# EAGLE design kartusho2 (EAGLE 7.3.0)
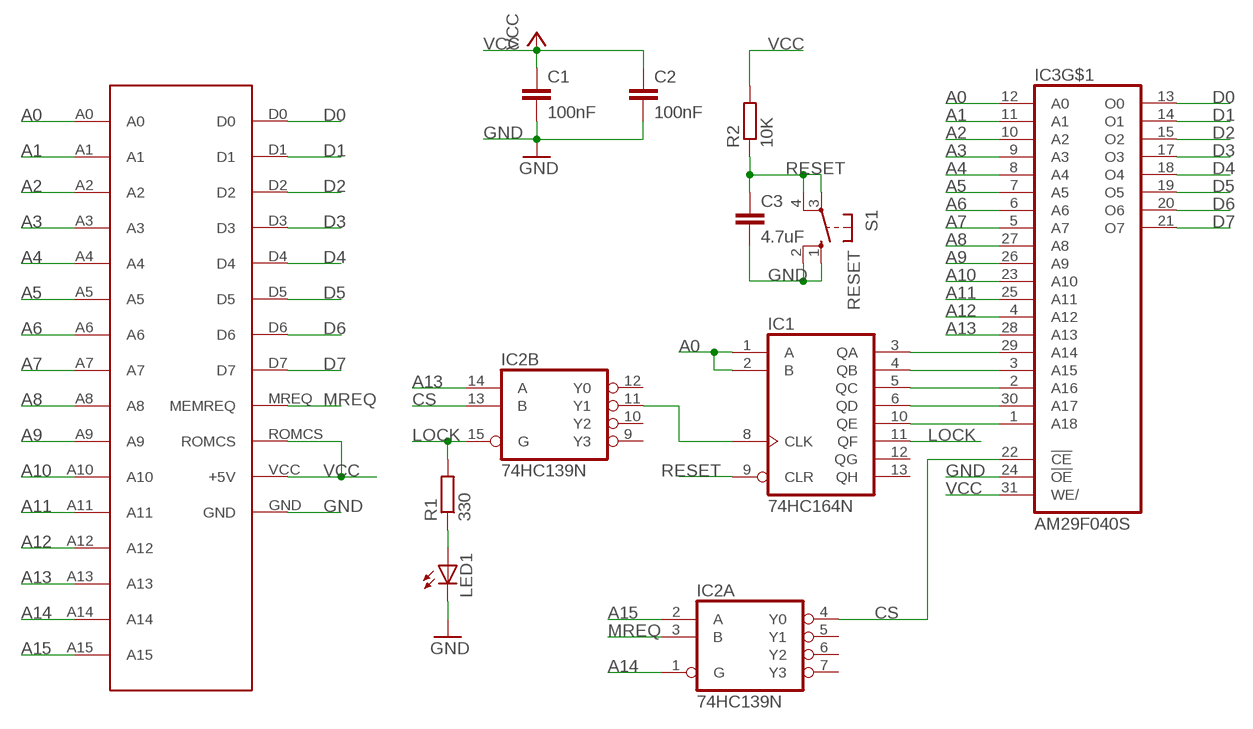
[diagram p0: schematic, sheet 1]

## Parts
C1  100nF  C-EU025-025X050  [C025-025X050]
C2  100nF  C-EU025-025X050  [C025-025X050]
C3  4.7uF  C-EU025-025X050  [C025-025X050]
IC1  74HC164N  [DIL14]
IC2  74HC139N  [DIL16]
IC3  AM29F040S  [PLCC-SR32]
LED1  LED3MM  [LED3MM]
R1  330  R-EU_0204/7  [0204/7]
R2  10K  R-EU_0204/7  [0204/7]
S1  RESET  10-XX  [B3F-10XX]
U$1  IF2BUS  [BUS_CARTUCHO_IF2]

## Nets
A0: IC1.1(A) IC1.2(B) IC3.12(A0) U$1.A0
A1: IC3.11(A1) U$1.A1
A2: IC3.10(A2) U$1.A2
A3: IC3.9(A3) U$1.A3
A4: IC3.8(A4) U$1.A4
A5: IC3.7(A5) U$1.A5
A6: IC3.6(A6) U$1.A6
A7: IC3.5(A7) U$1.A7
A8: IC3.27(A8) U$1.A8
A9: IC3.26(A9) U$1.A9
A10: IC3.23(A10) U$1.A10
A11: IC3.25(A11) U$1.A11
A12: IC3.4(A12) U$1.A12
A13: IC2.14(B:A) IC3.28(A13) U$1.A13
A14: IC2.1(A:G) U$1.A14
A15: IC2.2(A:A) U$1.A15
CS: IC2.4(A:Y0) IC2.13(B:B) IC3.22(!CE)
D0: IC3.13(O0) U$1.D0
D1: IC3.14(O1) U$1.D1
D2: IC3.15(O2) U$1.D2
D3: IC3.17(O3) U$1.D3
D4: IC3.18(O4) U$1.D4
D5: IC3.19(O5) U$1.D5
D6: IC3.20(O6) U$1.D6
D7: IC3.21(O7) U$1.D7
GND: C1.2 C2.2 C3.2 IC3.24(!OE) LED1.K(C) S1.1(S) S1.2(S1) U$1.GND
LOCK: IC1.11(QF) IC2.15(B:G) R1.2
MREQ: IC2.3(A:B) U$1.MREQ(MEMREQ)
N$1: IC1.8(CLK) IC2.11(B:Y1)
N$2: IC1.10(QE) IC3.1(A18)
N$3: IC1.6(QD) IC3.30(A17)
N$4: IC1.5(QC) IC3.2(A16)
N$5: IC1.4(QB) IC3.3(A15)
N$6: IC1.3(QA) IC3.29(A14)
N$7: LED1.A R1.1
RESET: C3.1 IC1.9(CLR) R2.1 S1.3(P) S1.4(P1)
VCC: C1.1 C2.1 IC3.31(WE/) R2.2 U$1.ROMCS U$1.VCC(+5V)
Unconnected: IC1.12(QG) IC1.13(QH) IC2.5(A:Y1) IC2.6(A:Y2) IC2.7(A:Y3) IC2.9(B:Y3) IC2.10(B:Y2) IC2.12(B:Y0)

## Power pins joined to a net without a drawn wire
GND: IC1.7(GND) IC2.8(P:GND) IC3.16(GND)
VCC: IC1.14(VCC) IC2.16(P:VCC) IC3.32(VCC)

## Library data of the parts
C1-C3 = rcl:C-EU: CAPACITOR, European symbol
IC1 = 74xx-us:74*164: 8-bit parallel out SHIFT REGISTER
IC2 = 74xx-eu:74*139: Dual 2-line to 4-line DECODER/DEMULTIPLEXER
IC3 = am29-memory:AM29F040S
LED1 = led:LED: LED OSRAM: - CHIPLED LG R971, LG N971, LY N971, LG Q971, LY Q971, LO R971, LY R971 LH N974, LH R974 LS Q976, LO Q976, LY Q976 LO Q996 - Hyper CHIPLED LW Q18S LB Q993, LB Q99A, LB R99A - SideLED LS A670, LO A670, LY A670, LG A670, LP A670 LB A673, LV A673, LT A673, LW A673 LH A674 LY A675 LS A676, LA A676, LO A676, LY A676, LW A676 LS A679, LY A679, LG A679 - Hyper Micro SIDELED® LS Y876, LA Y876, LO Y876, LY Y876 LT Y87S - SmartLED LW L88C, LW L88S LB L89C, LB L89S, LG L890 LS L89K, LO L89K, LY L89K LS L896, LA L896, LO L896, LY L896 - TOPLED LS T670, LO T670, LY T670, LG T670, LP T670 LSG T670, LSP T670, LSY T670, LOP T670, LYG T670 LG T671, LOG T671, LSG T671 LB T673, LV T673, LT T673, LW T673 LH T674 LS T676, LA T676, LO T676, LY T676, LB T676, LH T676, LSB T676, LW T676 LB T67C, LV T67C, LT T67C, LS T67K, LO T67K, LY T67K, LW E67C LS E67B, LA E67B, LO E67B, LY E67B, LB E67C, LV E67C, LT E67C LW T67C LS T679, LY T679, LG T679 LS T770, LO T770, LY T770, LG T770, LP T770 LB T773, LV T773, LT T773, LW T773 LH T774 LS E675, LA E675, LY E675, LS T675 LS T776, LA T776, LO T776, LY T776, LB T776 LHGB T686 LT T68C, LB T68C - Hyper Mini TOPLED® LB M676 - Mini TOPLED Santana® LG M470 LS M47K, LO M47K, LY M47K Source: http://www.osram.convergy.de LUXEON: - LUMILED® LXK2-PW12-R00, LXK2-PW12-S00, LXK2-PW14-U00, LXK2-PW14-V00 LXK2-PM12-R00, LXK2-PM12-S00, LXK2-PM14-U00 LXK2-PE12-Q00, LXK2-PE12-R00, LXK2-PE12-S00, LXK2-PE14-T00, LXK2-PE14-U00 LXK2-PB12-K00, LXK2-PB12-L00, LXK2-PB12-M00, LXK2-PB14-N00, LXK2-PB14-P00, LXK2-PB14-Q00 LXK2-PR12-L00, LXK2-PR12-M00, LXK2-PR14-Q00, LXK2-PR14-R00 LXK2-PD12-Q00, LXK2-PD12-R00, LXK2-PD12-S00 LXK2-PH12-R00, LXK2-PH12-S00 LXK2-PL12-P00, LXK2-PL12-Q00, LXK2-PL12-R00 Source: www.luxeon.com KINGBRIGHT: KA-3528ASYC Source: www.kingbright.com
R1 R2 = rcl:R-EU_: RESISTOR, European symbol
S1 = switch-omron:10-XX: OMRON SWITCH; MPN: B3F-1000; OC_FARNELL: 176432; OC_NEWARK: 36M3542
U$1 = SPECTRUM:IF2BUS

## Board
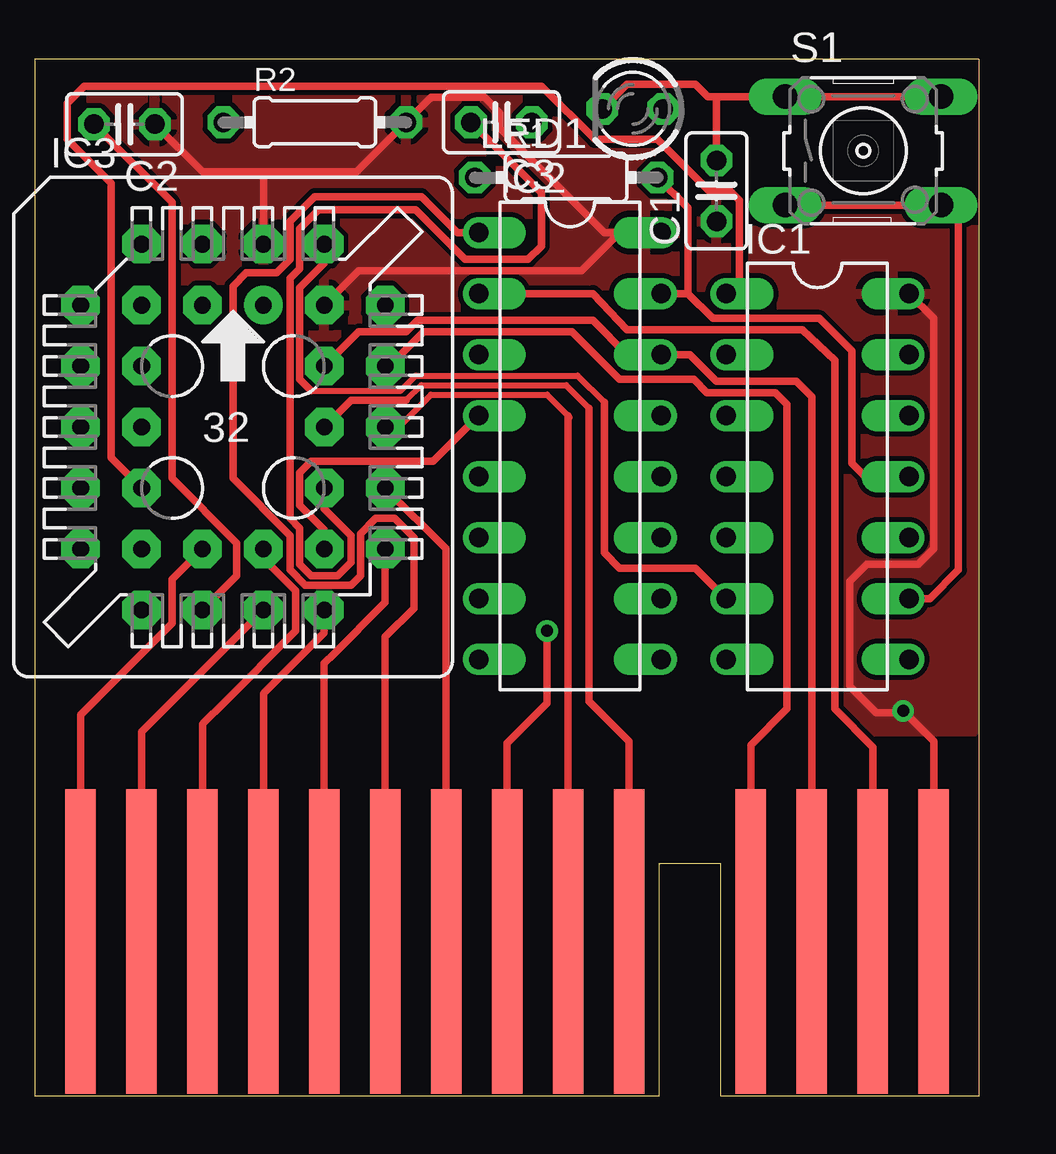
[diagram p1: board, top side]
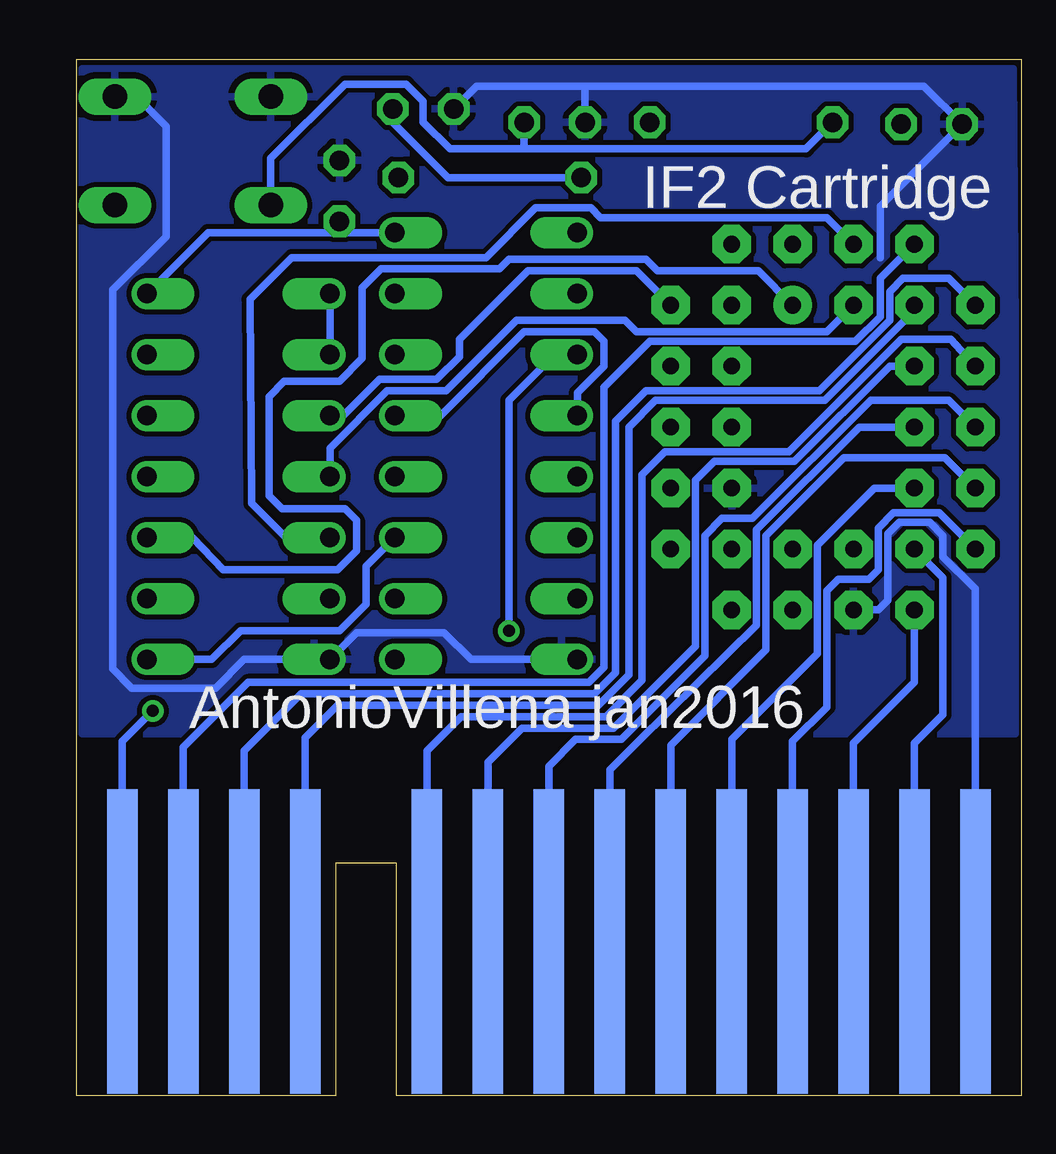
[diagram p2: board, bottom side, seen from below]

No outline drawn. Coordinates in mm, seen from the top.
Copper layers (1*16): Top 0.035mm / dielectric 1.5mm / Bottom 0.035mm
Design rules "default": minimum track width 10mil, minimum drill 24mil, track to track 8mil, track to pad 8mil, pad to pad 8mil, via to via 8mil, smd to smd 8mil, copper to edge 40mil, drill to drill 8mil, minimum pad ring 10mil, minimum via ring 8mil, stop-mask expansion 4mil, vias tented up to drill 0mil, thermal gap 10mil
Milling: 8 lines

### Footprints (pad centres in the part's own frame; a part is rotated, then mirrored left to right if it is on the bottom)
C025-025X050 = drill 0.813 octagon: 1 -1.27,0; 2 1.27,0
DIL14 = drill 0.813 offset: 1 -7.62,-3.81; 2 -5.08,-3.81; 3 -2.54,-3.81; 4 0,-3.81; 5 2.54,-3.81; 6 5.08,-3.81; 7 7.62,-3.81; 8 7.62,3.81; 9 5.08,3.81; 10 2.54,3.81; 11 0,3.81; 12 -2.54,3.81; 13 -5.08,3.81; 14 -7.62,3.81
DIL16 = drill 0.813 offset: 1 -8.89,-3.81; 2 -6.35,-3.81; 3 -3.81,-3.81; 4 -1.27,-3.81; 5 1.27,-3.81; 6 3.81,-3.81; 7 6.35,-3.81; 8 8.89,-3.81; 9 8.89,3.81; 10 6.35,3.81; 11 3.81,3.81; 12 1.27,3.81; 13 -1.27,3.81; 14 -3.81,3.81; 15 -6.35,3.81; 16 -8.89,3.81
PLCC-SR32 = drill 0.7 pad 1.6: 1 1.27,5.08 | drill 0.7 pad 1.6 octagon: 2 -1.27,7.62; 3 -1.27,5.08; 4 -3.81,7.62; 5 -6.35,5.08; 6 -3.81,5.08; 7 -6.35,2.54; 8 -3.81,2.54; 9 -6.35,0; 10 -3.81,0; 11 -6.35,-2.54; 12 -3.81,-2.54; 13 -6.35,-5.08; 14 -3.81,-7.62; 15 -3.81,-5.08; 16 -1.27,-7.62; 17 -1.27,-5.08; 18 1.27,-7.62; 19 1.27,-5.08; 20 3.81,-7.62; 21 6.35,-5.08; 22 3.81,-5.08; 23 6.35,-2.54; 24 3.81,-2.54; 25 6.35,0; 26 3.81,0; 27 6.35,2.54; 28 3.81,2.54; 29 6.35,5.08; 30 3.81,7.62; 31 3.81,5.08; 32 1.27,7.62
LED3MM = drill 0.813 octagon: A -1.27,0; K 1.27,0
0204/7 = drill 0.813 octagon: 1 -3.81,0; 2 3.81,0
B3F-10XX = drill 1.016 long: 1 -3.251,2.261; 2 3.251,2.261; 3 -3.251,-2.261; 4 3.251,-2.261
BUS_CARTUCHO_IF2 = smd 1.27 x 12.7 bottom: A0 -27.305,6.35; A1 -24.765,6.35; A2 -22.225,6.35; A3 -19.685,6.35; A4 -17.145,6.35; A5 -14.605,6.35; A6 -9.525,6.35; A7 -6.985,6.35; A12 -4.445,6.35; D0 -29.845,6.35; D1 -32.385,6.35; D2 -34.925,6.35; GND -37.465,6.35; ROMCS -1.905,6.35 | smd 1.27 x 12.7: A8 -9.525,6.35; A9 -14.605,6.35; A10 -22.225,6.35; A11 -17.145,6.35; A13 -6.985,6.35; A14 -24.765,6.35; A15 -4.445,6.35; D3 -37.465,6.35; D4 -34.925,6.35; D5 -32.385,6.35; D6 -29.845,6.35; D7 -27.305,6.35; MREQ -19.685,6.35; VCC -1.905,6.35

### Placement (x,y rotation side)
C1  28.42,37.7 90 top
C2  3.73,40.48 180 top
C3  19.45,40.56 180 top
IC1  32.62,25.8 270 top
IC2  22.3,27.07 270 top
IC3  8.26,27.86 0 top
LED1  24.92,41.12 180 top
R1  22.15,38.26 0 top
R2  11.67,40.56 0 top
S1  34.53,39.37 0 top
U$1  39.37,0.08 0 top

### Tracks (layer width: path | path; a pad name or v marks a point on that pad's centre or on a via)
A0
  Top 0.305: IC3.12 3.17,26.59 3.17,38.02 1.35,39.85 1.35,41.35 2.06,42.07 21.11,42.07 23.34,39.85 25.96,39.85 28.1,37.7 28.97,37.7 29.37,37.31 29.37,33.97 IC1.1
  Bottom 0.305: IC1.1 IC1.2 | IC3.12 6.11,25.32 8.49,22.94 8.49,18.41 12.06,14.84 U$1.A0
A1
  Bottom 0.305: IC3.11 3.17,26.59 7.38,26.59 10.64,23.34 10.64,18.57 14.61,14.61 U$1.A1 14.61,6.35
A2
  Bottom 0.305: IC3.10 6.75,27.86 11.03,23.57 11.03,19.61 15.95,14.76 17.14,13.57 U$1.A2
A3
  Bottom 0.305: IC3.9 3.02,28.97 6.27,28.97 11.19,24.05 12.46,24.05 13.18,23.34 13.18,18.34 16.67,14.84 18.57,14.84 19.68,13.73 U$1.A3
A4
  Bottom 0.305: IC3.8 5.48,30.4 9.45,26.43 12.78,26.43 13.57,25.64 13.57,18.73 16.99,15.32 20.8,15.32 22.23,13.89 U$1.A4
A5
  Bottom 0.305: IC3.7 2.94,31.51 5,31.51 9.68,26.83 14.84,26.83 15.8,25.88 15.8,17.3 17.3,15.8 23.34,15.8 24.77,14.37 U$1.A5 24.77,6.11
A6
  Bottom 0.305: IC3.6 4.45,32.7 8.18,28.97 15.24,28.97 16.35,27.86 16.35,17.54 17.62,16.27 28.5,16.27 29.84,14.92 U$1.A6
A7
  Bottom 0.305: IC3.5 3.02,34.05 4.92,34.05 5.48,33.5 5.48,32.31 8.41,29.37 15.64,29.37 16.91,28.1 16.91,17.62 17.78,16.75 30,16.75 32.38,14.37 U$1.A7 32.38,6.11
A8
  Top 0.305: IC3.27 14.76,30.4 16.19,31.83 22.38,31.83 24.37,29.84 27.46,29.84 28.02,29.29 30.88,29.29 31.35,28.81 31.35,16.11 29.84,14.61 U$1.A8
A9
  Top 0.254: 15.48,28.97 16.11,29.61 22.15,29.61 23.1,28.65
  Top 0.305: IC3.26 13.18,28.97 15.48,28.97 | 23.1,28.65 23.1,16.43 24.77,14.76 U$1.A9
A10
  Top 0.305: U$1.A10 17.14,22.78 IC3.23
A11
  Top 0.254: 15.16,27.86 16.51,29.21 21.35,29.21 22.23,28.34 22.3,28.26
  Top 0.305: IC3.25 15.16,27.86 | U$1.A11 22.23,28.34
A12
  Bottom 0.305: IC3.4 5.87,34.05 5.87,32.46 6.91,31.43 15.48,31.43 17.38,29.53 17.38,17.86 18.02,17.22 32.23,17.22 34.92,14.53 U$1.A12 34.92,6.27
A13
  Top 0.305: IC3.28 13.49,31.83 15.48,31.83 15.95,32.31 23.26,32.31 24.69,30.88 IC2.14 27.3,30.88 28.42,29.77 31.75,29.77 32.38,29.13 U$1.A13
A14
  Top 0.305: IC2.1 17.62,35.96 16.11,37.47 11.67,37.47 10.64,36.43 10.64,34.85 10.08,34.29 8.81,34.29 8.26,33.73 8.26,25.72 10.64,23.34 10.64,21.91 11.27,21.27 13.18,21.27 13.57,21.67 13.57,23.42 14.21,24.05 15,24.05 15.8,23.26 15.8,20.32 14.61,19.13 U$1.A14
A15
  Top 0.305: IC2.2 23.26,33.42 24.69,31.91 31.99,31.91 33.34,30.64 33.34,16.11 34.92,14.53 U$1.A15 34.92,6.35
CS
  Top 0.305: IC3.22 12.06,23.57 11.03,24.61 11.03,25.96 11.51,26.43 16.59,26.43 IC2.4
  Bottom 0.305: IC2.4 18.49,29.29 17.38,30.4 17.38,31.43 17.78,31.83 20.72,31.83 24.21,28.34 IC2.13
D0
  Bottom 0.305: IC3.13 3.41,24.29 5.32,24.29 5.95,23.65 5.95,21.91 6.35,21.51 7.62,21.51 8.1,21.03 8.1,16.19 9.53,14.76 U$1.D0
D1
  Bottom 0.305: IC3.14 4.45,17.22 6.99,14.68 U$1.D1
D2
  Bottom 0.305: IC3.15 3.25,21.59 3.25,15.88 4.45,14.68 U$1.D2
D3
  Top 0.305: IC3.17 5.71,21.51 5.71,19.68 2.86,16.83 1.98,15.95 1.91,15.88 U$1.D3
D4
  Top 0.305: IC3.18 4.45,15.16 U$1.D4
D5
  Top 0.305: IC3.19 9.53,22.38 10.87,21.03 10.87,19.37 7.86,16.35 7.06,15.56 6.99,15.48 U$1.D5
D6
  Top 0.305: IC3.20 12.06,19.29 10,17.22 9.6,16.83 9.53,16.75 U$1.D6
D7
  Top 0.305: IC3.21 14.61,20.56 12.38,18.34 12.14,18.1 12.06,18.02 U$1.D7
GND
  Top 0.305: IC3.16 8.41,21.67 8.41,23.02 5.71,25.72 5.71,37.23 C2.2 | 28.34,41.63 S1.1 S1.2 | 28.34,41.63 28.06,41.63 27.54,42.15 24.69,42.15 LED1.K | IC3.24 12.06,24.45 13.18,23.34 13.18,22.23 12.62,21.67 11.51,21.67 11.03,22.15 11.03,23.65 10.64,24.05 10.64,34.05 11.03,34.45 11.03,36.12 11.83,36.91 15.88,36.91 17.94,34.85 20.56,34.85 21.11,35.4 21.11,37.62 C3.2 | C1.2 28.42,41.55 28.34,41.63
  Bottom 0.305: IC3.16 5.95,20.24 5.56,20.64 5.56,23.42 5.08,23.89 3.81,23.89 3.25,23.34 3.25,22.46 1.91,21.11 U$1.GND | 5.87,34.92 5.87,37.07 C2.2 4.05,42.07 18.18,42.07 | IC2.8 22.94,18.18 24.05,19.29 27.7,19.29 IC1.7 32.38,18.18 33.58,16.99 37.07,16.99 37.86,17.78 37.86,33.58 35.64,35.8 35.64,40.4 36.87,41.63 S1.2 | C3.2 18.18,42.07 | 18.18,42.07 22.7,42.07 LED1.K
  pour Bottom: 0.32,42.78 39.13,42.78 39.13,15.08 0.24,15.08 0.24,31.83
LOCK
  Top 0.305: IC1.11 34.61,25.8 34.05,26.35 34.05,31.04 32.7,32.38 28.26,32.38 27.23,33.42 | R1.2 27.23,36.99 27.23,33.42 | IC2.15 27.23,33.42
MREQ  (via drill 0.5)
  Top 0.305: v21.35,19.37 21.35,16.35 20.48,15.48 19.76,14.76 19.68,14.68 U$1.MREQ
  Bottom 0.305: v21.35,19.37 21.35,28.97 19.45,30.88 IC2.3
N$1
  Bottom 0.305: IC1.8 33.73,18.18 32.54,19.37 28.42,19.37 27.3,20.48 27.3,22.07 IC2.11
N$2
  Bottom 0.305: IC3.1 10.95,34.37 15.16,34.37 15.64,34.85 21.35,34.85 21.75,34.45 26.67,34.45 27.46,33.66 27.46,30.72 28.42,29.77 30.72,29.77 31.35,29.13 31.35,25 30.8,24.45 28.18,24.45 27.7,23.97 27.7,22.7 28.5,21.91 33.26,21.91 34.53,23.26 IC1.10
N$3
  Top 0.254: 11.51,29.37 15.24,29.37 15.88,30 22.62,30 23.73,28.89
  Top 0.305: IC3.30 12.06,34.69 11.03,33.66 11.03,29.84 11.51,29.37 | 23.73,28.89 23.73,22.62 24.37,21.99 27.54,21.99 IC1.6
N$4
  Bottom 0.305: IC3.2 8.1,36.59 17.54,36.59 17.94,36.99 20.24,36.99 22.3,34.92 30.4,34.92 32.15,33.18 32.07,24.69 30.64,23.26 IC1.5
N$5
  Bottom 0.305: IC3.3 8.1,31.83 16.03,31.83 16.51,32.31 21.03,32.31 23.97,29.37 26.43,29.37 28.81,26.99 IC1.4
N$6
  Bottom 0.305: IC3.29 16.03,34.37 20.56,34.37 23.42,31.51 23.42,30.8 24.37,29.84 26.75,29.84 28.26,28.34 IC1.3
N$7
  Bottom 0.305: R1.1 23.89,38.26 26.19,40.56 LED1.A
RESET
  Top 0.305: S1.3 37.7,37.11 | 37.7,37.11 S1.4 38.5,36.39 38.5,21.91 37.31,20.72 IC1.9 | 37.78,37.03 37.7,37.11
  Bottom 0.305: R2.1 8.97,39.45 20.8,39.45 | C3.1 20.72,39.53 20.8,39.45 | 20.8,39.45 23.81,39.45 24.92,40.56 24.92,41.43 25.64,42.15 28.18,42.15 31.27,39.05 S1.3
VCC  (via drill 0.5)
  Top 0.305: IC3.32 9.53,38.5 | U$1.ROMCS 37.47,14.76 v36.2,16.03 36.12,15.95 35.08,15.95 33.97,17.07 33.97,21.43 34.69,22.15 36.83,22.15 37.47,22.78 37.47,32.38 IC1.14 | IC3.31 13.49,34.37 22.78,34.37 24.37,35.96 IC2.16 23.73,35.96 19.37,40.32 19.37,40.96 18.73,41.59 16.51,41.59 R2.2 13.41,38.5 9.53,38.5 | 9.53,38.5 6.99,38.5 C2.1
  Bottom 0.305: v36.2,16.03 37.47,14.76 U$1.ROMCS | IC2.16 28.34,35.96 | 28.34,35.96 33.89,35.96 IC1.14 | C1.1 28.42,36.04 28.34,35.96
  pour Top: 0.32,42.78 39.13,42.78 39.13,15.16 0.32,15.08

### Text on the board
bPlace: IF2 Cartridge | AntonioVillena jan2016